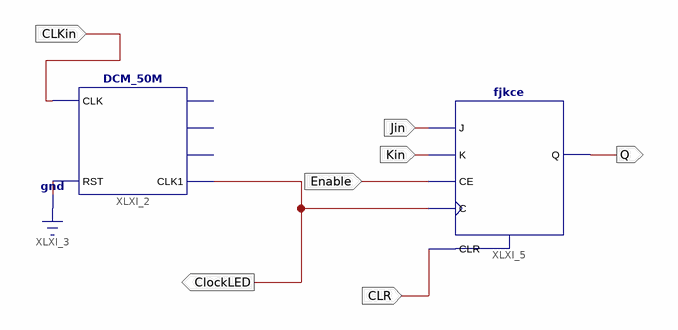
[diagram p0: schematic sheet 1]
// Xilinx ISE schematic lab7_experiment6.sch (spartan3e) as structural Verilog: 2 symbols, 7 ports
module lab7_experiment6 (
  input  Enable,
  input  Kin,
  input  CLKin,
  input  CLR,
  input  Jin,
  output ClockLED,
  output Q
);

  DCM_50M XLXI_2 (.CLK(CLKin), .RST(1'b0), .CLK1(ClockLED));  // open: CLK1M, CLK10k, CLK1k
  fjkce XLXI_5 (.C(ClockLED), .CE(Enable), .CLR(CLR), .J(Jin), .K(Kin), .Q(Q));
endmodule
